# EAGLE design main (EAGLE 6.1)
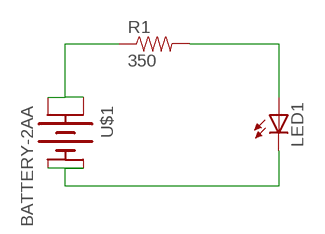
[diagram p0: schematic, sheet 1]

## Parts
LED1  LED5MM  [LED5MM]
R1  350  RESISTOR1206  [1206]
U$1  BATTERY-2AA  [BATTERY-AA]

## Nets
N$1: R1.1 U$1.PWR@1(+1) U$1.PWR@2(+2)
N$2: LED1.A R1.2
N$3: LED1.K(C) U$1.GND@1(-1) U$1.GND@2(-2)

## Library data of the parts
LED1 = SparkFun:LED: LEDs Standard schematic elements and footprints for 5mm, 3mm, 1206, and 0603 sized LEDs. 5mm - Spark Fun Electronics SKU : COM-00529 (and others)
R1 = SparkFun:RESISTOR: Resistor Basic schematic elements and footprints for 0603, 1206, and PTH 1/10th watt (small) resistors.
U$1 = SparkFun:BATTERY-2

## Board
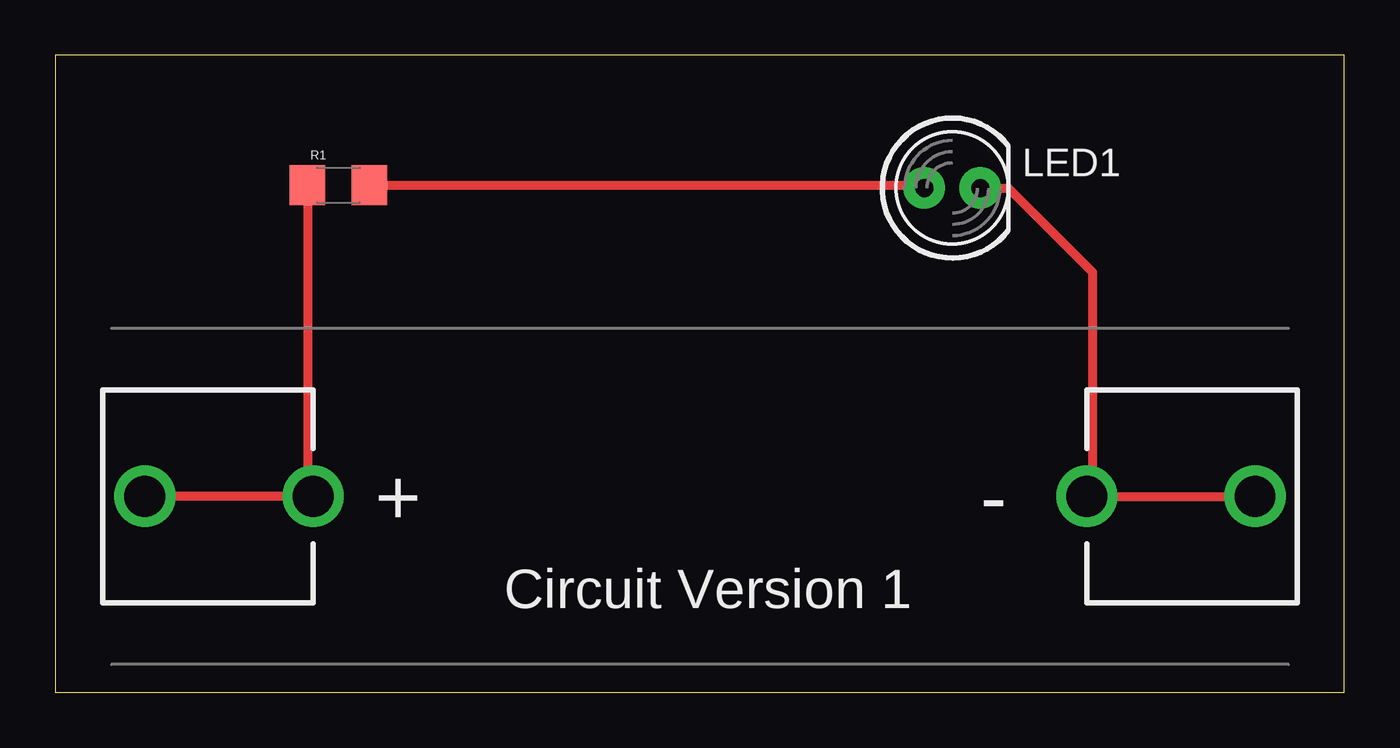
[diagram p1: board, top side]

Size 58.4 x 28.88 mm. Coordinates in mm from the lower left corner, seen from the top.
Outline: 0,0 58.4,0 58.4,28.88 0,28.88 0,0
Copper layers (1*16): Top 0.035mm / dielectric 1.5mm / Bottom 0.035mm
Design rules: minimum track width 10mil, minimum drill 24mil, track to track 8mil, track to pad 8mil, pad to pad 8mil, via to via 8mil, smd to smd 8mil, copper to edge 40mil, drill to drill 8mil, minimum pad ring 10mil, minimum via ring 8mil, stop-mask expansion 4mil, vias tented up to drill 0mil, thermal gap 10mil

### Footprints (pad centres in the part's own frame; a part is rotated, then mirrored left to right if it is on the bottom)
LED5MM = drill 0.813 pad 1.88: A -1.27,0; K 1.27,0
1206 = smd 1.6 x 1.8: 1 -1.4,0; 2 1.4,0
BATTERY-AA = drill 1.854: GND@1 25.146,0; GND@2 17.526,0; PWR@1 -25.146,0; PWR@2 -17.526,0

### Placement (x,y rotation side)
LED1  40.64,22.86 0 top
R1  12.83,22.99 0 top
U$1  29.21,8.89 0 top

### Tracks (layer width: path | path; a pad name or v marks a point on that pad's centre or on a via)
N$1
  Top 0.406: R1.1 11.43,9.14 U$1.PWR@2 U$1.PWR@1
N$2
  Top 0.406: R1.2 39.24,22.99 LED1.A
N$3
  Top 0.406: LED1.K 43.18,22.86 46.99,19.05 46.99,8.89 U$1.GND@2 U$1.GND@1

### Text on the board
tPlace: Circuit Version 1